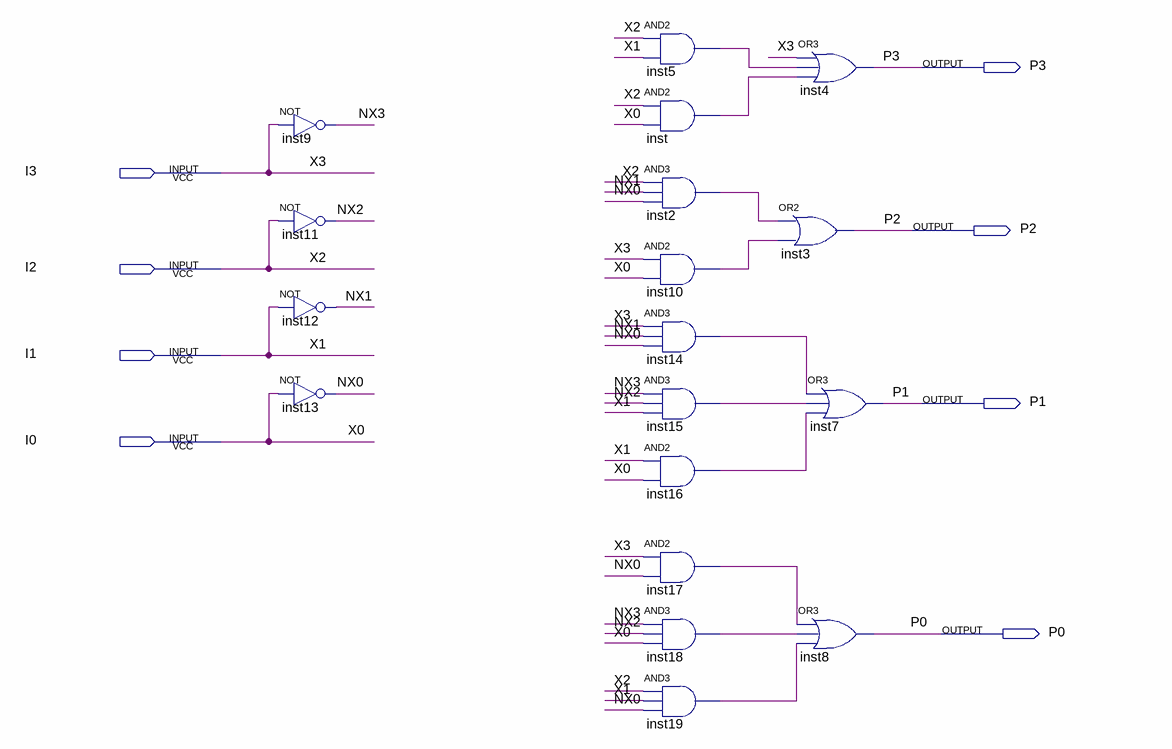
[diagram p0: schematic sheet]
// Quartus schematic Add3.bdf as structural Verilog: 18 symbols, 8 pins
module Add3 (
  input  I3,
  input  I2,
  input  I1,
  input  I0,
  output P3,
  output P2,
  output P1,
  output P0
);

  wire inst2_out, inst5_out, inst10_out, inst14_out, inst15_out, inst16_out, inst17_out, inst18_out,
       inst19_out, inst_out, NX0, NX1, NX2, NX3;

  not inst9 (NX3, I3);
  not inst11 (NX2, I2);
  not inst12 (NX1, I1);
  not inst13 (NX0, I0);
  and inst5 (inst5_out, I2, I1);
  and inst (inst_out, I2, I0);
  and inst2 (inst2_out, I2, NX1, NX0);
  and inst10 (inst10_out, I3, I0);
  and inst14 (inst14_out, I3, NX1, NX0);
  and inst15 (inst15_out, NX3, NX2, I1);
  and inst16 (inst16_out, I1, I0);
  and inst17 (inst17_out, I3, NX0);
  and inst18 (inst18_out, NX3, NX2, I0);
  and inst19 (inst19_out, I2, I1, NX0);
  or inst3 (P2, inst2_out, inst10_out);
  or inst4 (P3, I3, inst5_out, inst_out);
  or inst7 (P1, inst14_out, inst15_out, inst16_out);
  or inst8 (P0, inst17_out, inst18_out, inst19_out);

  // Other names for the same wires on the sheet: X0 = I0; X1 = I1; X2 = I2; X3 = I3
endmodule
